# Altium schematic sheet GPSDO_FRONT.SchDoc
size A
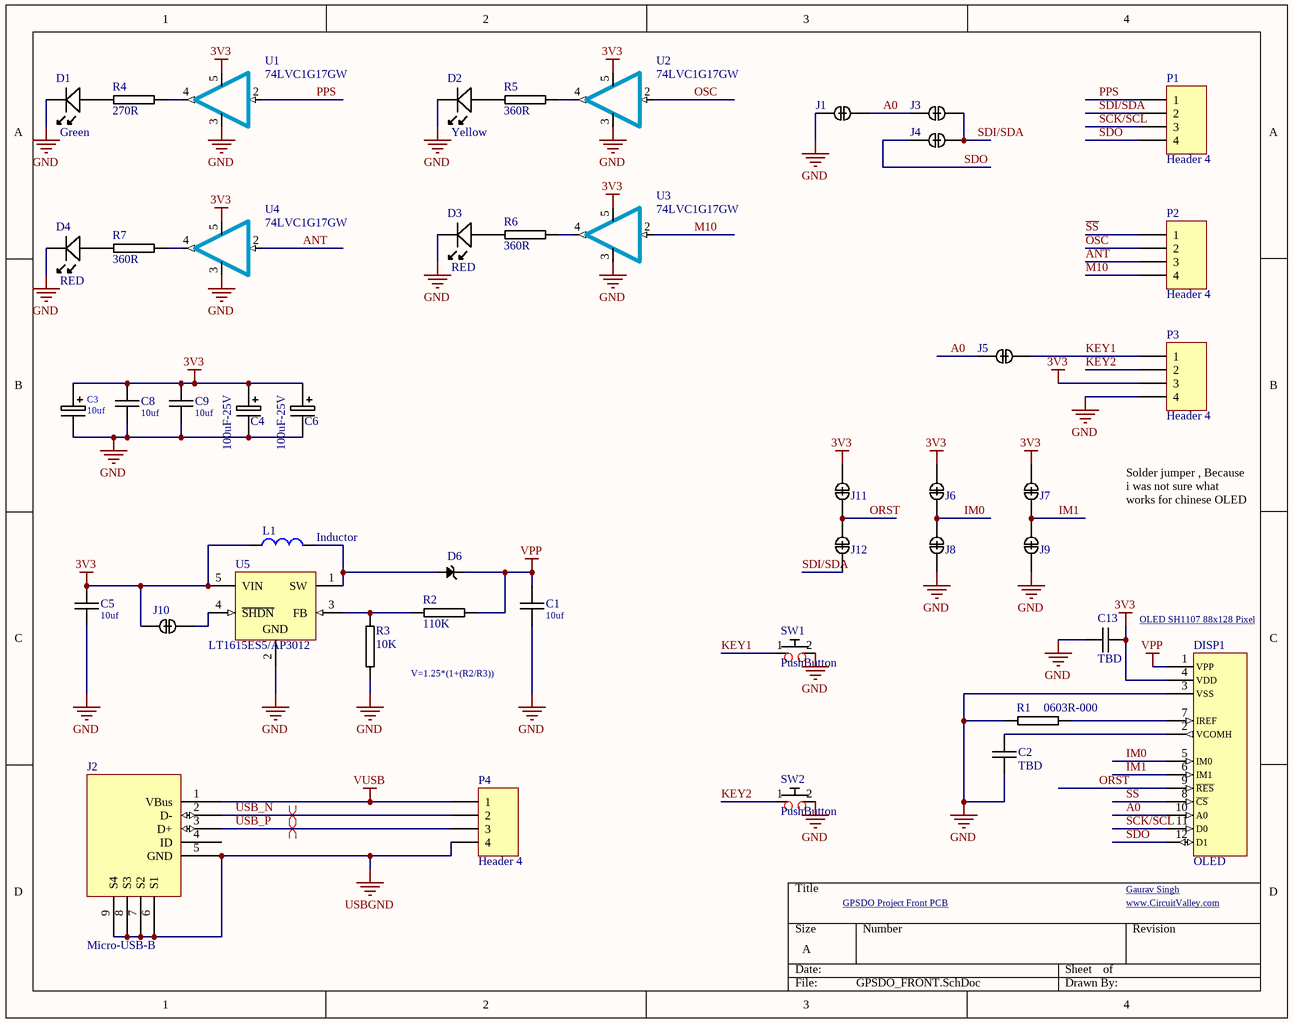
[diagram p0: GPSDO_FRONT.SchDoc]

## Parts
C1  10uf  [1210C-GENERIC]
C2  TBD  [0805C-TBD]
C3  10uf  [CAPMP3528X210N]
C4  100uF-25V  [PANACAP-D-GENERIC]
C5  10uf  [1210C-GENERIC]
C6  100uF-25V  [PANACAP-D-GENERIC]
C8  10uf  [1210C-GENERIC]
C9  10uf  [1210C-GENERIC]
C13  TBD  [0805C-TBD]
D1  Green  [KPTL-3216SURCK-01]
D2  Yellow  [KPTL-3216SURCK-01]
D3  RED  [KPTL-3216SURCK-01]
D4  RED  [KPTL-3216SURCK-01]
D6  (no value)  [Diode_0603]
DISP1  OLED  [OLED QT1107P05C]
J1  BYPASS-MINI-CLOSED  [BYPASS-MINI-CLOSED]  (value not drawn)
J2  Micro-USB-B  [10118193-0001lfc]
J3  BYPASS-MINI-CLOSED  [BYPASS-MINI-CLOSED]  (value not drawn)
J4  BYPASS-MINI-CLOSED  [BYPASS-MINI-CLOSED]  (value not drawn)
J5  BYPASS-MINI-CLOSED  [BYPASS-MINI-CLOSED]  (value not drawn)
J6  BYPASS-MINI-CLOSED  [BYPASS-MINI-CLOSED]  (value not drawn)
J7  BYPASS-MINI-CLOSED  [BYPASS-MINI-CLOSED]  (value not drawn)
J8  BYPASS-MINI-CLOSED  [BYPASS-MINI-CLOSED]  (value not drawn)
J9  BYPASS-MINI-CLOSED  [BYPASS-MINI-CLOSED]  (value not drawn)
J10  BYPASS-MINI-CLOSED  [BYPASS-MINI-CLOSED]  (value not drawn)
J11  BYPASS-MINI-CLOSED  [BYPASS-MINI-CLOSED]  (value not drawn)
J12  BYPASS-MINI-CLOSED  [BYPASS-MINI-CLOSED]  (value not drawn)
L1  Inductor  [IFSC-1515AH-01]
P1  Header 4  [M20-8770446 4PIN]
P2  Header 4  [M20-8770446 4PIN]
P3  Header 4  [M20-8770446 4PIN]
P4  Header 4  [22-23-2041]
R1  0603R-000  [0603R-GENERIC]
R2  110K  [0603R-GENERIC]
R3  10K  [0603R-GENERIC]
R4  270R  [0603R-GENERIC]
R5  360R  [0603R-GENERIC]
R6  360R  [0603R-GENERIC]
R7  360R  [0603R-GENERIC]
SW1  PushButton  [EVQ-11A04R]
SW2  PushButton  [EVQ-11A04R]
U1  74LVC1G17GW  [SC70-5]
U2  74LVC1G17GW  [SC70-5]
U3  74LVC1G17GW  [SC70-5]
U4  74LVC1G17GW  [SC70-5]
U5  LT1615ES5/AP3012  [LT-S5-5-TSOT-23_N]

## Nets
3V3: C3.1 C4.+ C5.2 C6.+ C8.2 C9.2 C13.2 DISP1.4(VDD) J6.2 J7.2 J10.2 J11.2 L1.1 P3.3 U1.5(VCC) U2.5(VCC) U3.5(VCC) U4.5(VCC) U5.5(VIN)
GND: C1.1 C2.1 C3.2 C4.- C5.1 C6.- C8.1 C9.1 C13.1 D1.K D2.K D3.K D4.K DISP1.3(VSS) J1.1 J8.1 J9.1 P3.4 R1.1 R3.1 SW1.2(P2) SW2.2(P2) U1.3(GND) U2.3(GND) U3.3(GND) U4.3(GND) U5.2(GND)
USBGND: J2.5(GND) J2.6(S1) J2.7(S2) J2.8(S3) J2.9(S4) P4.4
VPP: C1.2 D6.2 DISP1.1(VPP) R2.2
VUSB: J2.1(VBus) P4.1
A0: DISP1.10(A0) J1.2 J3.1 J5.1
ANT: P2.3 U4.2
IM0: DISP1.5(IM0) J6.1 J8.2
IM1: DISP1.6(IM1) J7.1 J9.2
KEY1: J5.2 P3.1 SW1.1(P1)
KEY2: P3.2 SW2.1(P1)
M10: P2.4 U3.2
ORST: DISP1.9(~{RES}) J11.1 J12.2
OSC: P2.2 U2.2
PPS: P1.1 U1.2
~{SS}: DISP1.8(~{CS}) P2.1
SCK/SCL: DISP1.11(D0) P1.3
SDI/SDA: J3.2 J4.1 J12.1 P1.2
SDO: DISP1.12(D1) J4.2 P1.4
USB_N: J2.2(D-) P4.2
USB_P: J2.3(D+) P4.3
NetC2_2: C2.2 DISP1.2(VCOMH)
NetD1_A: D1.A R4.1
NetD2_A: D2.A R5.1
NetD3_A: D3.A R6.1
NetD4_A: D4.A R7.1
NetD6_1: D6.1 L1.2 U5.1(SW)
NetDISP1_7: DISP1.7(IREF) R1.2
NetJ10_1: J10.1 U5.4(~{SHDN})
NetR2_1: R2.1 R3.2 U5.3(FB)
NetR4_2: R4.2 U1.4
NetR5_2: R5.2 U2.4
NetR6_2: R6.2 U3.4
NetR7_2: R7.2 U4.4

Not connected (* = marked no-connect by the designer): J2 4(ID)

## Layout directives
differential pair: USB_N, USB_P

## Notes on the sheet
- Solder jumper , Because i was not sure what works for chinese OLED
- OLED SH1107 88x128 Pixel
- V=1.25*(1+(R2/R3))
- GPSDO Project Front PCB
- (near DISP1) Gaurav Singh
- www.CircuitValley.com

## Library data of the parts
C1 C5 C8 C9 = 1210C-2u2-35V: GENERIC CAPACITOR NON POLARISED 1210; Manufacturer: Panasonic - ECG; Manufacturer Part Number: ECJ-4YB0J226M; Reel: C25; Supplier 1: Digi-Key; Supplier Part Number 1: 587-2255-2-ND
C2 C13 = 0805C-TBD: CAPACITOR 0805 CERAMIC VALUE TO BE DETERMINED
C3 = CAPT_47u_1210_6V3: Capacitor SMD Tantalum 47uF 20% 6.3V 1210; Manufacturer 1: AVX Corporation; Manufacturer Part Number 1: TCJB476M006R0070; Manufacturer Size Code: B; Voltage - Rated: 6V3; ESR (Equivalent Series Resistance): 70.0 mOhm; Type: Molded; Package / Case: 1210 (3528 Metric); Tolerance: ±20%; Material: Tantalum; Supplier 1: Digi-Key; Supplier Part Number 1: 478-3139-1-ND; Operating Temperature: -55°C ~ 125°C; Size / Dimension: 0.138" L x 0.110" W (3.50mm x 2.80mm); Height - Seated (Max): 0.083" (2.10mm); ComponentLink1URL: http://www.avx.com/docs/Catalogs/tcj.pdf; ComponentLink1Description: http://www.avx.com/docs/Catalogs/tcj.pdf; Value: 10uf
C4 C6 = PANACAP-100UF-16V-FK: GENERIC CAPACITOR POLARISED; Supplier 1: Digi-Key; Supplier Part Number 1: PCE3783TR-ND
D1-D4 = KPTL-3216SURCK-01
D6 = Schottky_diode
DISP1 = OLED QT1107P05C
J1 J3-J12 = BYPASS-MINI-CLOSED: SOLDERDOT BYPASS; Manufacturer Part Number 1: Board Feature; Reel: Closed; Supplier 1: Solder-it-yourself; Manufacturer 1: Board feature
L1 = inductor_smd
P1-P4 = Header 4: Header, 4-Pin; LatestRevisionDate: 17-Jul-2002; LatestRevisionNote: Re-released for DXP Platform.; Publisher: Altium Limited
R1-R7 = 0603R-000: GENERIC RESISTOR 0603
U1-U4 = 74LVC1G17GW-Q100
U5 = LT1615ES5: Micropower Step-Up DC/DC Converter, 5-pin SOT23 (S5-5), -40 to 85 degC; Manufacturer: Linear Technology; Number of Outputs: 1; PackageVersion: Jun-10; PackageReference: S5-5; PackageDescription: 5-Pin Plastic TSOT-23, Body 1.63 x 2.90 mm, Pitch 0.95 mm; RoHS: FALSE; Mounting Technology: Surface Mount; Code_JEDEC: MO-193; PartNumber: LT1615ES5; ComponentLink1Description: Manufacturer URL; ComponentLink1URL: http://www.linear.com/; ComponentLink2Description: Datasheet; ComponentLink2URL: http://cds.linear.com/docs/en/datasheet/16151fas.pdf; ComponentLink3Description: Package Specification; ComponentLink3URL: http://cds.linear.com/docs/en/packaging/SOT_5_05-08-1635.pdf
J2 = Micro-USB-B: Mouser: https://www.mouser.de/Search/ProductDetail.aspx?R=10118193-0001LFvirtualkey64910000virtualkey649-10118193-0001LF